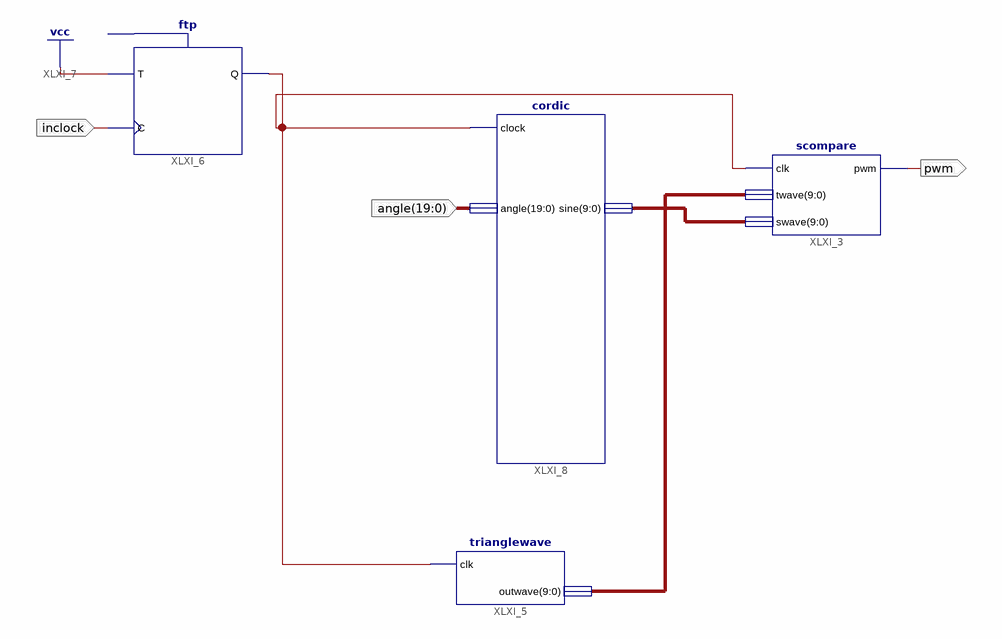
[diagram p0: schematic sheet 1]
// Xilinx ISE schematic spwmmodule.sch (spartan6) as structural Verilog: 4 symbols, 3 ports
module spwmmodule (
  input  inclock,
  input  [19:0] angle,
  output pwm
);

  wire inc;
  wire [9:0] XLXN_6, XLXN_7;

  scompare XLXI_3 (.clk(inc), .twave(XLXN_7), .swave(XLXN_6), .pwm(pwm));
  trianglewave XLXI_5 (.clk(inc), .outwave(XLXN_7));
  ftp XLXI_6 (.C(inclock), .T(1'b1), .Q(inc));  // open: PRE
  cordic XLXI_8 (.clock(inc), .angle(angle), .sine(XLXN_6));
endmodule
